# Altium schematic sheet kvm.SchDoc: =ProjectTitle
size A3; PageSetup: Record=PageOptions|CenterHorizontal=True|CenterVertical=True|PrintScale=0.94|XCorrection=1.00|YCorrection=1.00|PrintKind=1|BorderSize=5000000|LeftOffset=0|BottomOffset=0|Orientation=2|PaperLength=1000|PaperWidth=1000|Scale=100|PaperSource=15|PrintQuality=600|MediaType=1|DitherType=10|PrintScaleMode=1|PaperKind=11x17; Author: Jaime I. Chait; Organization: NWES LLC; Address1: 111 SW 5th Ave, STE 3150; Address2: Portland, OR 97204; SheetNumber: 1; SheetTotal: 1
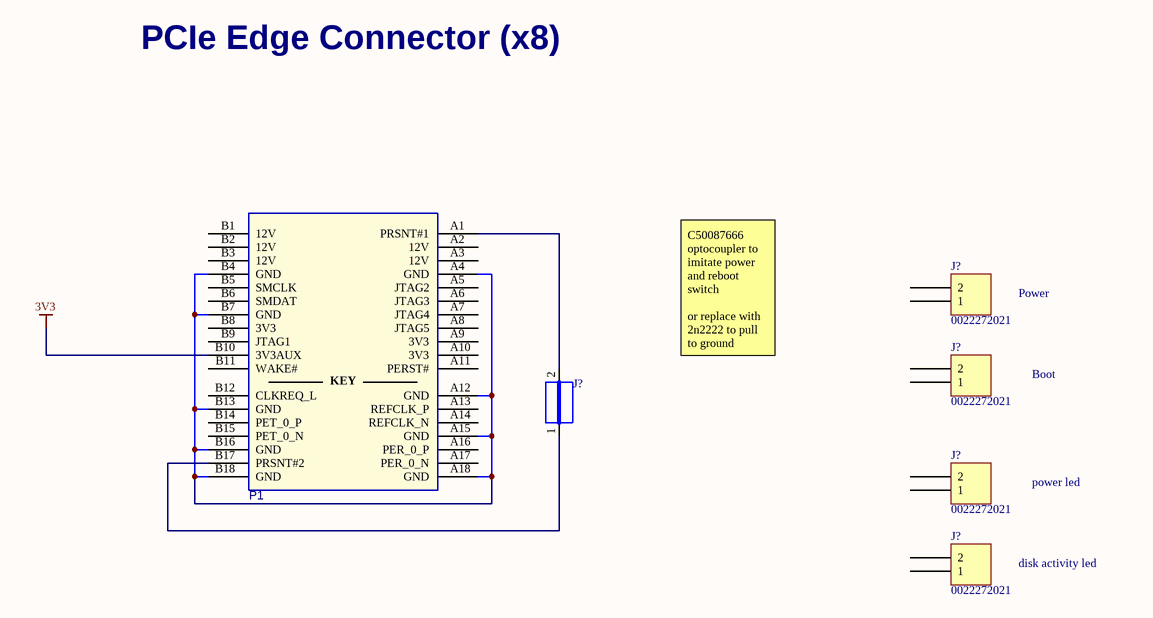
[diagram p0: kvm.SchDoc]

## Parts
(Parts that share a designator on the sheet are numbered #1, #2 ... from top to bottom, then left to right.)
J?#1  0022272021  [MOLEX KK 0022272021]
J?#2  0022272021  [MOLEX KK 0022272021]
J?#3  JUMPER  [JUMPER]  (value not drawn)
J?#4  0022272021  [MOLEX KK 0022272021]
J?#5  0022272021  [MOLEX KK 0022272021]
P1  PCIUV32BIT  [GF-2D-1000-1K-O98]  (value not drawn)  (no BOM)

## Nets
3V3: P1.B10(3V3AUX)
NetJ?#3_1: J?#3.1 P1.B17(PRSNT#2)
NetJ?#3_2: J?#3.2 P1.A1(PRSNT#1)
NetP1_A4: P1.A4(GND) P1.A12(GND) P1.A15(GND) P1.A18(GND) P1.B4(GND) P1.B7(GND) P1.B13(GND) P1.B16(GND) P1.B18(GND)

Not connected (* = marked no-connect by the designer): J?#1 1 2; J?#2 1 2; J?#4 1 2; J?#5 1 2; P1 A2(12V) A3(12V) A5(JTAG2) A6(JTAG3) A7(JTAG4) A8(JTAG5) A9(3V3) A10(3V3) A11(PERST#) A13(REFCLK_P) A14(REFCLK_N) A16(PER_0_P) A17(PER_0_N) B1(12V) B2(12V) B3(12V) B5(SMCLK) B6(SMDAT) B8(3V3) B9(JTAG1) B11(WAKE#) B12(CLKREQ_L) B14(PET_0_P) B15(PET_0_N)

## Notes on the sheet
- PCIe Edge Connector (x8)
- Power
- C50087666 optocoupler to imitate power and reboot switch
  or replace with 2n2222 to pull to ground
- Boot
- power led
- disk activity led
- Title
- Size:
- Date:
- A4
- Number:
- Time:
- Revision:
- Sheet
- of
- File:
- (in symbol PCIUV32BIT) KEY

## Library data of the parts
J?#1 J?#2 J?#4 J?#5 = 0022272021: CONN HEADER VERT 2POS 2.54MM; Manufacturer: Molex; Contact Length - Mating: 0.295" (7.49mm); Contact Length - Post: 0.140" (3.56mm); Material Flammability Rating: UL94 V-0; Number of Positions: 2; Number of Positions Loaded: All; Overall Contact Length: 0.560" (14.22mm); Pitch - Mating: 0.100" (2.54mm); Shrouding: Shrouded - 1 Wall; Style: Board to Cable/Wire; Part Number: 0022272021; ComponentLink1Description: Datasheet; ComponentLink1URL: https://www.molex.com/pdm_docs/sd/022272021_sd.pdf; ComponentLink2Description: DigiKey Link; ComponentLink2URL: http://digikey.com/product-detail/en/molex/0022272021/WM4111-ND/1130577; Connector Type: Header; Contact Finish - Mating: Tin; Contact Finish - Post: Tin; Contact Finish Thickness - Mating: 100.0µin (2.54µm); Contact Material: Brass; Contact Shape: Square; Contact Type: Male Pin; Fastening Type: Friction Lock; Insulation Color: Natural; Insulation Height: 0.461" (11.70mm); Insulation Material: Polyamide (PA), Nylon; LastUpdated: 12.01.2020 23:51:43; Lifecycle Status: Active; Minimum Order: 1; Mounting Type: Through Hole; Number of Rows: 1; Packaging: Bulk; PartId: 76; Part Status: Active; Price: 0.27; Series: KK 6410; Supplier 1: DigiKey; Supplier Part Number 1: WM4111-ND; Termination: Solder
J?#3 = CMP-009-00061-2: Pins: 2
P1 = PCIUV32BIT: Card Edge, 98-Position